# EAGLE design LowTemp (EAGLE 6.4)
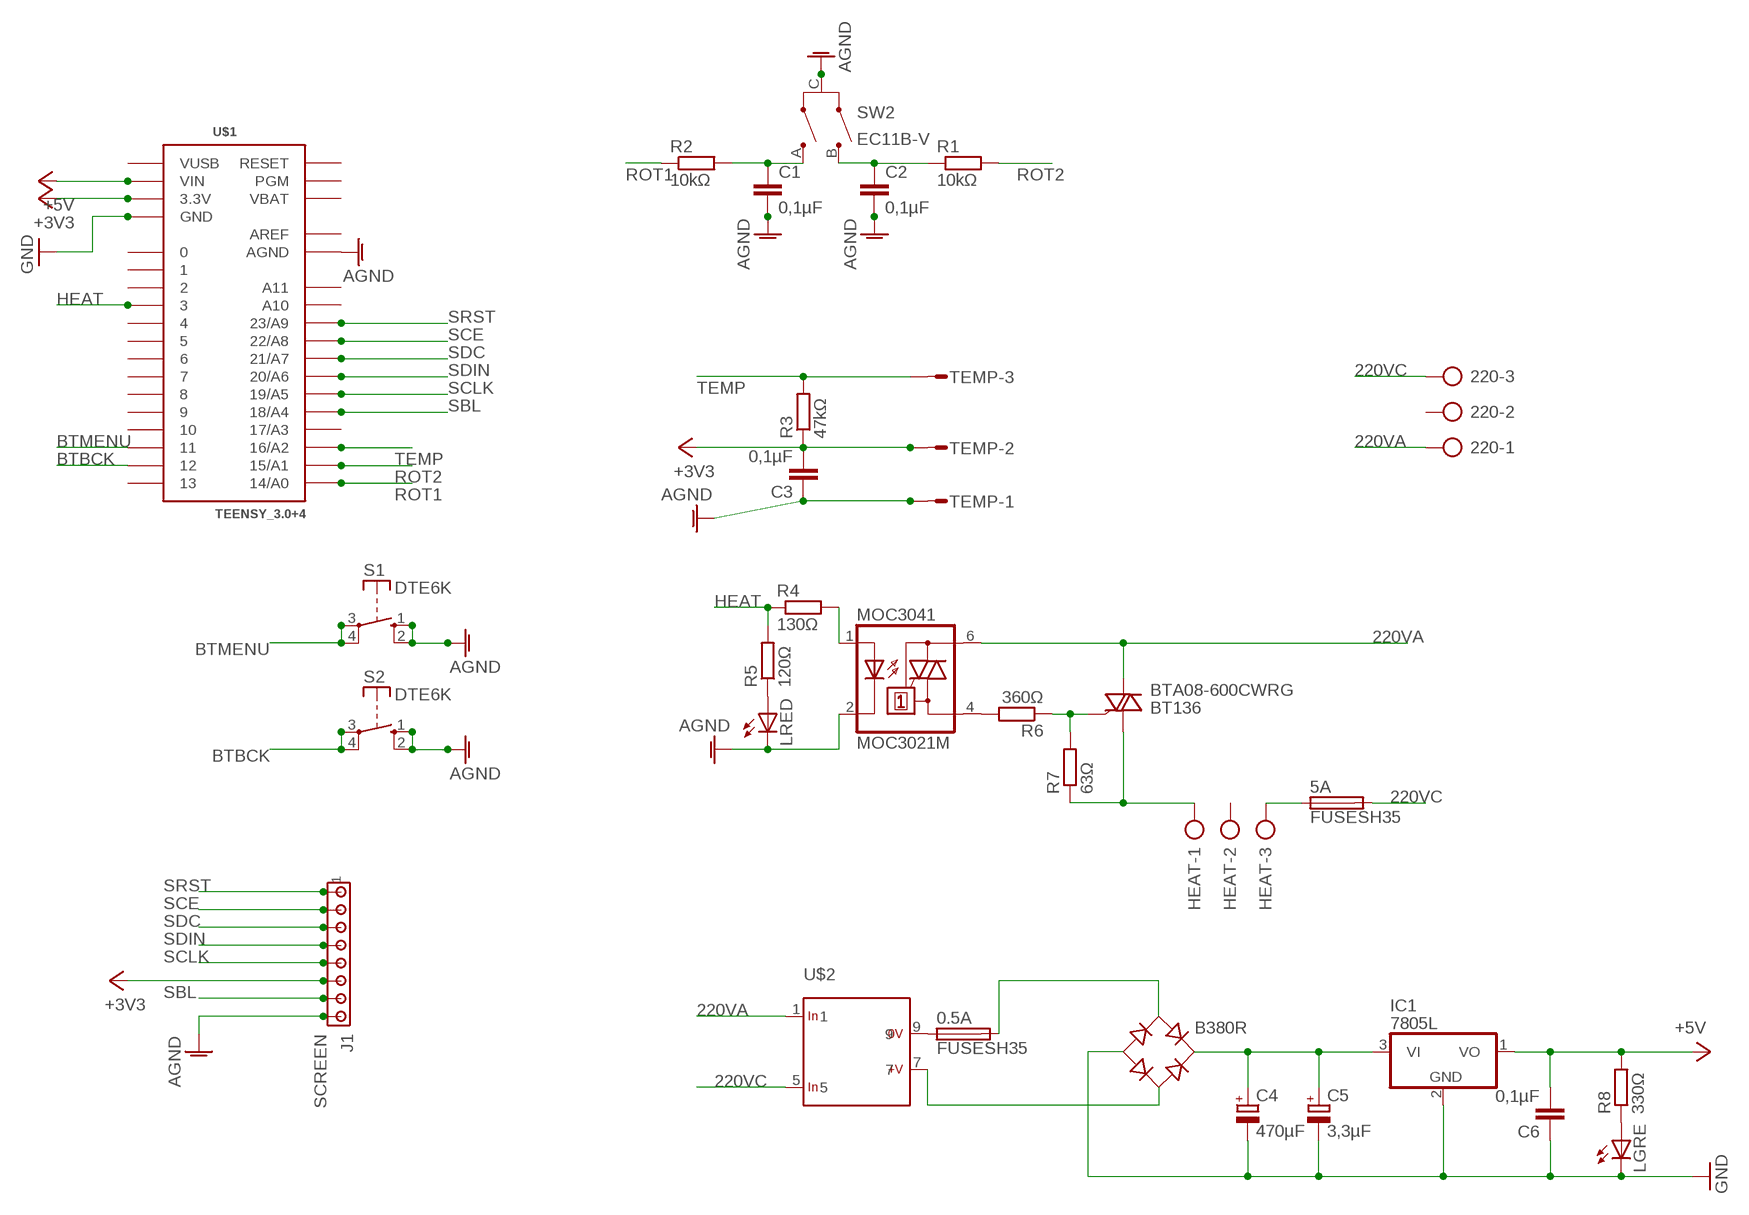
[diagram p0: schematic, sheet 1]

## Parts
0.5A  FUSESH35  [SH25]
5A  FUSESH35  [SH25]
220  AK500/3-H  [AK500/3-H]
B380R  RB1A  [RB1A]
BTA08-600CWRG  BT136  [TO220AB]
C1  0,1µF  C-EU050-025X075  [C050-025X075]
C2  0,1µF  C-EU050-025X075  [C050-025X075]
C3  0,1µF  C-EU050-025X075  [C050-025X075]
C4  470µF  CPOL-EUE5-8.5  [E5-8,5]
C5  3,3µF  CPOL-EUTT2D4  [TT2D4]
C6  0,1µF  C-EU050-025X075  [C050-025X075]
HEAT  AK500/3-H  [AK500/3-H]
IC1  7805L  [TO92]
J1  SCREEN  MTA08-100  [10X08MTA]
LGRE  LED5MM  [LED5MM]
LRED  LED5MM  [LED5MM]
MOC3041  MOC3021M  [DIL06]
R1  10kΩ  R-EU_0207/10  [0207/10]
R2  10kΩ  R-EU_0207/10  [0207/10]
R3  47kΩ  R-EU_0207/10  [0207/10]
R4  130Ω  R-EU_0207/10  [0207/10]
R5  120Ω  R-EU_0207/10  [0207/10]
R6  360Ω  R-EU_0207/10  [0207/10]
R7  63Ω  R-EU_0207/10  [0207/10]
R8  330Ω  R-EU_0207/10  [0207/10]
S1  DTE6K  [DTE6K]
S2  DTE6K  [DTE6K]
SW2  EC11B-V  [EC11B-V]
TEMP  L03P  [L03P]
U$1  TEENSY_3.0+4  [TEENSY_3.0+4]
U$2  SINGLE  [1]

## Nets
220VA: 220.1 BTA08-600CWRG.2(A2) MOC3041.6(A2) U$2.1
220VC: 5A.2 220.3 U$2.5
+3V3: C3.2 J1.6 R3.1 TEMP.2 U$1.3.3V U$1.3.3V1(3.3V)
+5V: C6.2 IC1.1(VO) R8.2 U$1.VIN
AGND: C1.2 C2.2 C3.1 J1.8 LRED.K(C) MOC3041.2(C) S1.1(S) S1.2(S) S2.1(S) S2.2(S) SW2.C TEMP.1 U$1.AGND
BTBCK: S2.3(P) S2.4(P) U$1.12
BTMENU: S1.3(P) S1.4(P) U$1.11
GND: B380R.- C4.- C5.- C6.1 IC1.2(GND) LGRE.K(C) U$1.GND U$1.GND1(GND)
HEAT: R4.1 R5.2 U$1.3
N$1: C1.1 R2.2 SW2.A
N$2: C2.1 R1.1 SW2.B
N$3: MOC3041.1(A) R4.2
N$4: LRED.A R5.1
N$5: MOC3041.4(A1) R6.2
N$6: BTA08-600CWRG.3(G) R6.1 R7.2
N$7: 0.5A.1 U$2.9
N$8: BTA08-600CWRG.1(A1) HEAT.1 R7.1
N$9: 5A.1 HEAT.3
N$10: B380R.AC2 U$2.7
N$11: 0.5A.2 B380R.AC1
N$13: B380R.+ C4.+ C5.+ IC1.3(VI)
N$15: LGRE.A R8.1
ROT1: R2.1 U$1.14/A0
ROT2: R1.2 U$1.15/A1
SBL: J1.7 U$1.18/A4
SCE: J1.2 U$1.22/A8
SCLK: J1.5 U$1.19/A5
SDC: J1.3 U$1.21/A7
SDIN: J1.4 U$1.20/A6
SRST: J1.1 U$1.23/A9
TEMP: R3.2 TEMP.3 U$1.16/A2
Unconnected: 220.2 HEAT.2 U$1.0 U$1.1 U$1.2 U$1.4 U$1.5 U$1.6 U$1.7 U$1.8 U$1.9 U$1.10 U$1.13 U$1.17/A3 U$1.A10 U$1.A11 U$1.PGM U$1.RESET

## Power pins joined to a net without a drawn wire
AREF: U$1.AREF
VBAT: U$1.VBAT
VUSB: U$1.VUSB

## Library data of the parts
0.5A 5A = fuse:FUSE: Fuse; OC_FARNELL: unknown; OC_NEWARK: unknown
220 HEAT = con-ptr500:AK500/3-H: CONNECTOR Aug. 2004 / PTR Meßtechnik: Die Bezeichnung der Serie AK505 wurde geändert. Es handelt sich hierbei um AK500 in horizontaler Ausführung.; OC_FARNELL: unknown; OC_NEWARK: unknown
B380R = rectifier:RB1A: RECTIFIER 1 A
BTA08-600CWRG = triac:BT136: Triac BT136 series E sensitive gate Source: http://www.nxp.com/acrobat_download/datasheets/BT136_SERIES_E_2.pdf
C1-C3 C6 = resistor:C-EU: CAPACITOR, European symbol
C4 C5 = resistor:CPOL-EU: POLARIZED CAPACITOR, European symbol
IC1 = linear:78*: Positive VOLTAGE REGULATOR Source: http://cache.national.com/ds/LM/LM78L05.pdf http://www.fairchildsemi.com/ds/LM/LM7805.pdf
J1 = con-amp:MTA08-100: AMP connector
LGRE LRED = led:LED: LED OSRAM: - CHIPLED LG R971, LG N971, LY N971, LG Q971, LY Q971, LO R971, LY R971 LH N974, LH R974 LS Q976, LO Q976, LY Q976 LO Q996 - Hyper CHIPLED LW Q18S LB Q993, LB Q99A, LB R99A - SideLED LS A670, LO A670, LY A670, LG A670, LP A670 LB A673, LV A673, LT A673, LW A673 LH A674 LY A675 LS A676, LA A676, LO A676, LY A676, LW A676 LS A679, LY A679, LG A679 - Hyper Micro SIDELED® LS Y876, LA Y876, LO Y876, LY Y876 LT Y87S - SmartLED LW L88C, LW L88S LB L89C, LB L89S, LG L890 LS L89K, LO L89K, LY L89K LS L896, LA L896, LO L896, LY L896 - TOPLED LS T670, LO T670, LY T670, LG T670, LP T670 LSG T670, LSP T670, LSY T670, LOP T670, LYG T670 LG T671, LOG T671, LSG T671 LB T673, LV T673, LT T673, LW T673 LH T674 LS T676, LA T676, LO T676, LY T676, LB T676, LH T676, LSB T676, LW T676 LB T67C, LV T67C, LT T67C, LS T67K, LO T67K, LY T67K, LW E67C LS E67B, LA E67B, LO E67B, LY E67B, LB E67C, LV E67C, LT E67C LW T67C LS T679, LY T679, LG T679 LS T770, LO T770, LY T770, LG T770, LP T770 LB T773, LV T773, LT T773, LW T773 LH T774 LS E675, LA E675, LY E675, LS T675 LS T776, LA T776, LO T776, LY T776, LB T776 LHGB T686 LT T68C, LB T68C - Hyper Mini TOPLED® LB M676 - Mini TOPLED Santana® LG M470 LS M47K, LO M47K, LY M47K Source: http://www.osram.convergy.de LUXEON: - LUMILED® LXK2-PW12-R00, LXK2-PW12-S00, LXK2-PW14-U00, LXK2-PW14-V00 LXK2-PM12-R00, LXK2-PM12-S00, LXK2-PM14-U00 LXK2-PE12-Q00, LXK2-PE12-R00, LXK2-PE12-S00, LXK2-PE14-T00, LXK2-PE14-U00 LXK2-PB12-K00, LXK2-PB12-L00, LXK2-PB12-M00, LXK2-PB14-N00, LXK2-PB14-P00, LXK2-PB14-Q00 LXK2-PR12-L00, LXK2-PR12-M00, LXK2-PR14-Q00, LXK2-PR14-R00 LXK2-PD12-Q00, LXK2-PD12-R00, LXK2-PD12-S00 LXK2-PH12-R00, LXK2-PH12-S00 LXK2-PL12-P00, LXK2-PL12-Q00, LXK2-PL12-R00 Source: www.luxeon.com KINGBRIGHT: KA-3528ASYC Source: www.kingbright.com
MOC3041 = optocoupler:MOC30*M: RANDOM-PHASE OPTOISOLATORS TRIAC DRIVER OUTPUT Source: http://www.fairchildsemi.com MOC3020-M.pdf; MF: FAIRCHILD SEMICONDUCTOR; MPN: MOC3021-M; OC_FARNELL: 1021365; OC_NEWARK: 95B7895
R1-R8 = resistor:R-EU_: RESISTOR, European symbol
S1 S2 = switch-misc:DT: ITT SWITCH
SW2 = alps:EC11B-V: ALPS EC11B Vertikal Ohne Taster Drehimpulsgeber 11 mm
TEMP = con-amp-mt:L03P: AMP MT CONNECTOR; OC_FARNELL: unknown; OC_NEWARK: unknown
U$1 = Teensy3.0:TEENSY_3.0+4: Teensy 3.0 board, showing all pins that are easily acessible. See 'AllAnalogPins" and 'AllPins' packages for additional pin holes, as needed. The 'Basic' package has fewer pins.
U$2 = myrra:SINGLE: One Output Input voltage range: 85 to 265 V AC or 85 to 370 V DC Input frequency: 47 to 440 Hz Output voltage accuracy (full load ): ± 2% Line output voltage variation: ± 0.3% Load output voltage variation: ± 0.5% Temperature range: -25 - TA (°C) No load input power: < 200mW regulated: Reference Output Current Power Efficiency Ta Volts mA Watts % °C 47121 3.3 750 2.5 65 +70 47122 5 550 2.75 68 +70 47123 9 270 2.5 72 +70 47124 12 210 2.5 74 +70 47125 15 170 2.5 75 +70 47126 24 110 2.5 77 +70 47151 3.3 1350 4.2 65 +50 47152 5 900 4.5 68 +50 47153 9 550 5 72 +50 47154 12 420 5 75 +50 47155 15 320 5 76 +50 47156 24 220 5 79 +50 non regulated: Reference Output Current Power Efficiency Ta Volts mA Watts % °C 47114 12 200 2.4 74 +70 47133 9 360 3.2 73 +70 47134 12 270 3.2 75 +70 47136 24 130 3.2 80 +70 47163 9 560 5* 73 +50 47164 12 420 5* 75 +50 47166 24 210 5* 80 +50 * Nota: Power up to 5.4W is possible with input voltage > 97 V AC Source: http://www.myrra.com

## Board
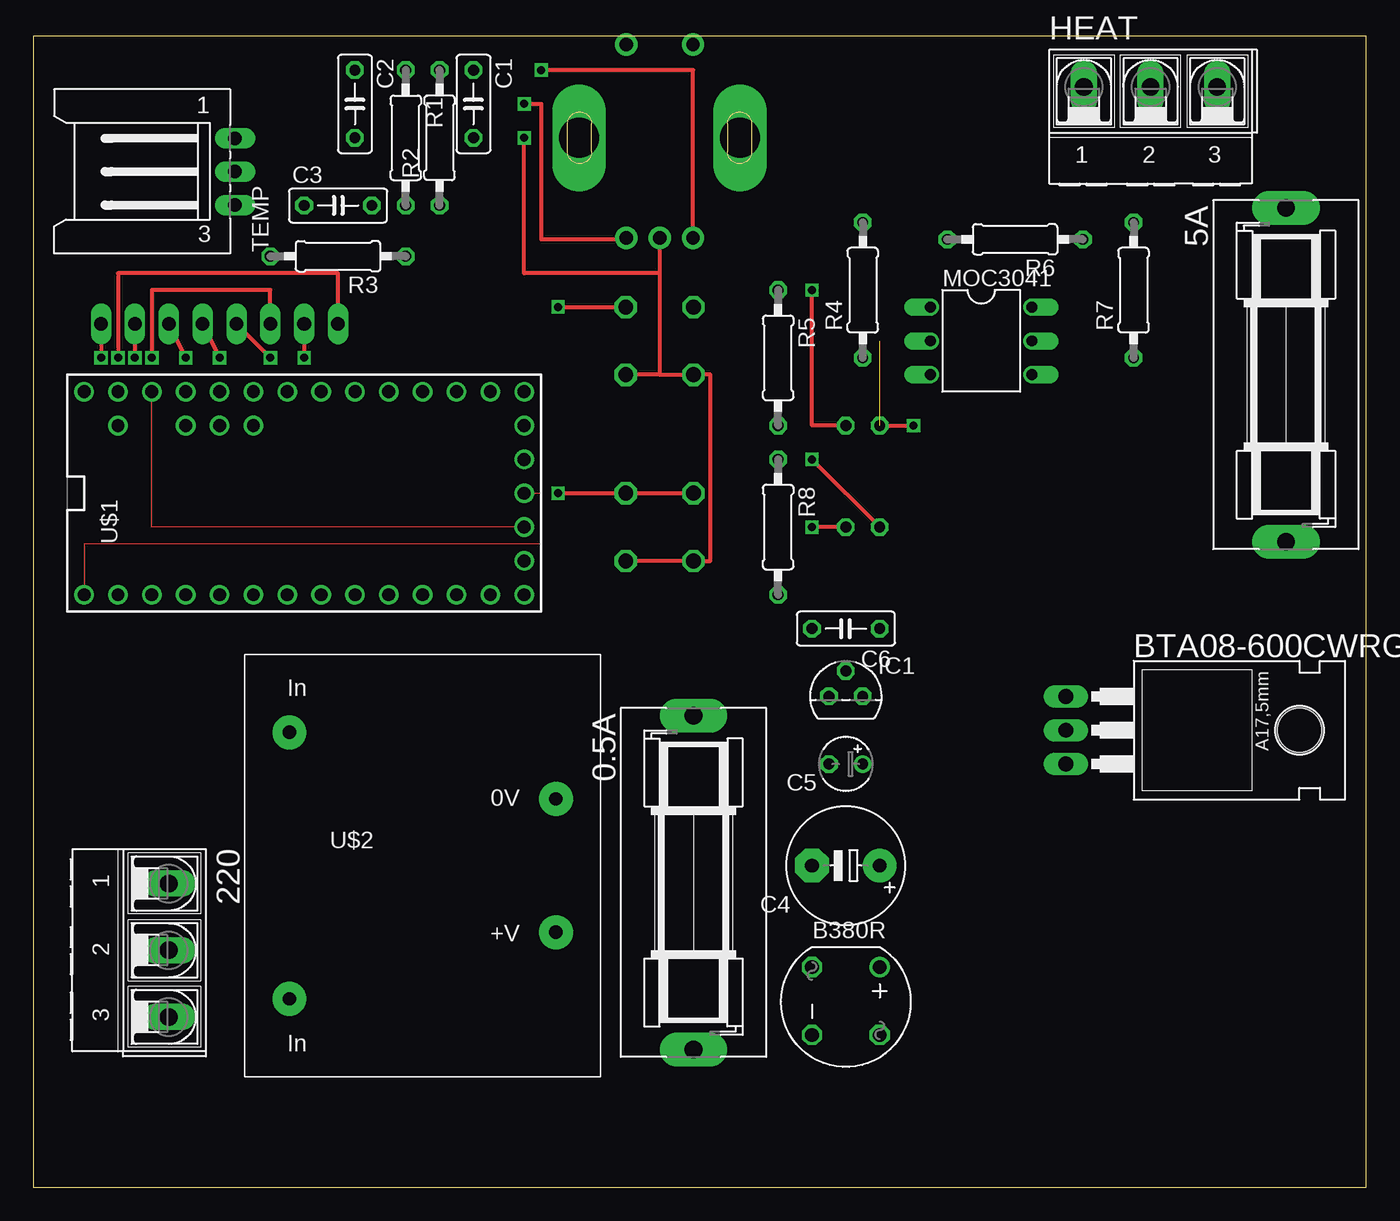
[diagram p1: board, top side]
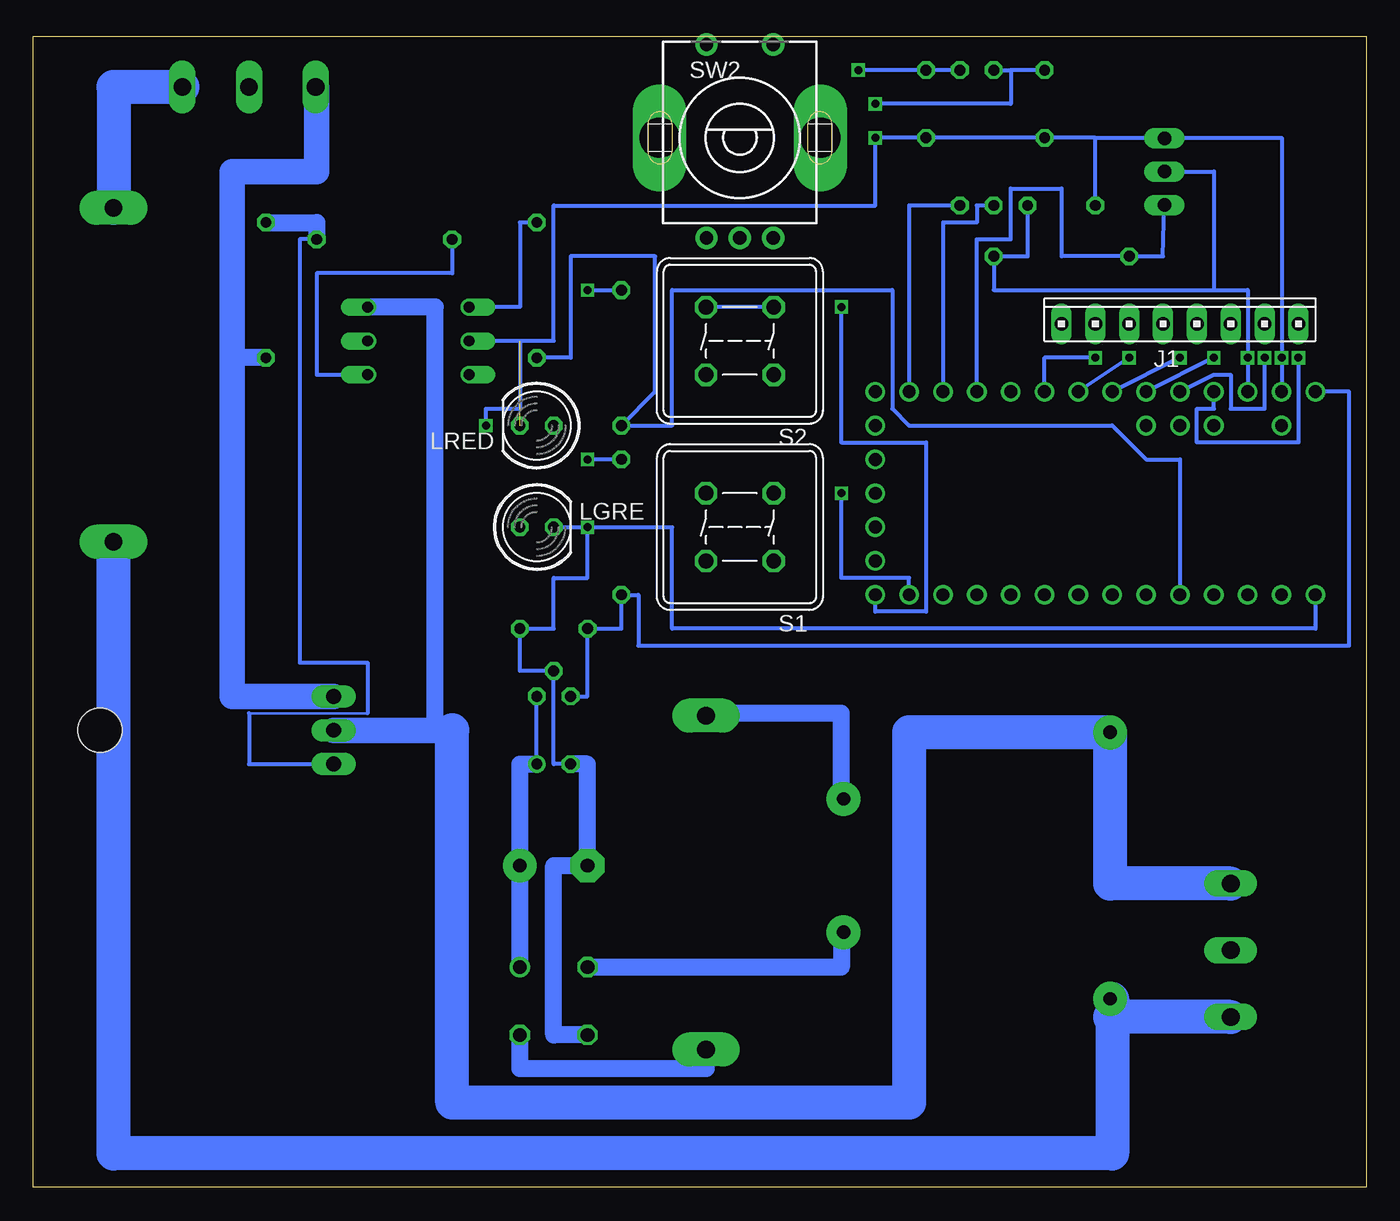
[diagram p2: board, bottom side, seen from below]

Size 100 x 86.35 mm. Coordinates in mm from the lower left corner, seen from the top.
Outline: 0,0 100,0 100,86.35 0,86.35 0,0
Copper layers (1*16): Top 0.035mm / dielectric 1.5mm / Bottom 0.035mm
Design rules "default": minimum track width 10mil, minimum drill 24mil, track to track 8mil, track to pad 8mil, pad to pad 8mil, via to via 8mil, smd to smd 8mil, copper to edge 40mil, drill to drill 8mil, minimum pad ring 10mil, minimum via ring 8mil, stop-mask expansion 4mil, vias tented up to drill 0mil, thermal gap 10mil

### Footprints (pad centres in the part's own frame; a part is rotated, then mirrored left to right if it is on the bottom)
SH25 = drill 1.321 pad 2.54 long: 1 -12.522,0; 2 12.522,0
AK500/3-H = drill 1.321 long: 1 -5.004,0; 2 0,0; 3 5.004,0
RB1A = drill 1.016: + -2.54,2.54 | drill 1.016 octagon: - 2.54,-2.54; AC1 2.54,2.54; AC2 -2.54,-2.54
TO220AB = drill 1.118 long: 1 -2.54,-6.35; 2 0,-6.35; 3 2.54,-6.35 | hole 3.302: 0,11.176
C050-025X075 = drill 0.813 octagon: 1 -2.54,0; 2 2.54,0
E5-8,5 = drill 1.016 pad 2.54: + -2.54,0 | drill 1.016 pad 2.54 octagon: - 2.54,0
TT2D4 = drill 0.813: + -1.27,0 | drill 0.813 octagon: - 1.27,0
TO92 = drill 0.813 octagon: 1 -1.27,0; 2 0,1.905; 3 1.27,0
10X08MTA = drill 1.016 long: 1 8.89,0; 2 6.35,0; 3 3.81,0; 4 1.27,0; 5 -1.27,0; 6 -3.81,0; 7 -6.35,0; 8 -8.89,0
LED5MM = drill 0.813 octagon: A -1.27,0; K 1.27,0
DIL06 = drill 0.813 offset: 1 -2.54,-3.81; 2 0,-3.81; 3 2.54,-3.81; 4 2.54,3.81; 5 0,3.81; 6 -2.54,3.81
0207/10 = drill 0.813 octagon: 1 -5.08,0; 2 5.08,0
DTE6K = drill 1.118 octagon: 1 -2.54,2.54; 2 2.54,2.54; 3 2.54,-2.54; 4 -2.54,-2.54
EC11B-V = drill 1 pad 1.676: A -2.5,-7.5; B 2.5,-7.5; C 0,-7.5; D -2.5,7; E 2.5,7 | drill 3 pad 3.3 long: G1 -6.032,0; G2 6.032,0
L03P = drill 1.016 long: 1 2.5,-6.25; 2 0,-6.25; 3 -2.5,-6.25
TEENSY_3.0+4 = drill 0.965: 0 -7.62,13.97; 1 -7.62,11.43; 2 -7.62,8.89; 3 -7.62,6.35; 3.3V 7.62,11.43; 3.3V1 -2.54,-16.51; 4 -7.62,3.81; 5 -7.62,1.27; 6 -7.62,-1.27; 7 -7.62,-3.81; 8 -7.62,-6.35; 9 -7.62,-8.89; 10 -7.62,-11.43; 11 -7.62,-13.97; 12 -7.62,-16.51; 13 7.62,-16.51; 14/A0 7.62,-13.97; 15/A1 7.62,-11.43; 16/A2 7.62,-8.89; 17/A3 7.62,-6.35; 18/A4 7.62,-3.81; 19/A5 7.62,-1.27; 20/A6 7.62,1.27; 21/A7 7.62,3.81; 22/A8 7.62,6.35; 23/A9 7.62,8.89; A10 5.08,6.35; A11 5.08,3.81; AGND 7.62,13.97; AREF 5.08,8.89; GND -7.62,16.51; GND1 0,-16.51; PGM 2.54,-16.51; RESET 5.08,-16.51; VBAT -5.08,-16.51; VIN 7.62,16.51; VUSB 5.08,13.97
1 = drill 1 pad 2.54: 1 -10,10; 5 -10,-10; 7 10,-5; 9 10,5

### Placement (x,y rotation side)
0.5A  49.53,22.86 270 top
5A  93.98,60.96 270 top
220  10.16,17.78 270 top
B380R  60.96,13.97 270 top
BTA08-600CWRG  83.82,34.29 270 top
C1  33.02,81.28 270 top
C2  24.13,81.28 270 top
C3  22.86,73.66 0 top
C4  60.96,24.13 180 top
C5  60.96,31.75 180 top
C6  60.96,41.91 180 top
HEAT  83.82,82.55 0 top
IC1  60.96,36.83 0 top
J1  13.97,64.77 0 bottom
LGRE  62.23,49.53 0 bottom
LRED  62.23,57.15 180 bottom
MOC3041  71.12,63.5 270 top
R1  27.94,78.74 270 top
R2  30.48,78.74 90 top
R3  22.86,69.85 180 top
R4  62.23,67.31 90 top
R5  55.88,62.23 270 top
R6  73.66,71.12 180 top
R7  82.55,67.31 90 top
R8  55.88,49.53 270 top
S1  46.99,49.53 180 bottom
S2  46.99,63.5 180 bottom
SW2  46.99,78.74 0 bottom
TEMP  8.89,76.2 90 top
U$1  20.32,52.07 90 top
U$2  29.21,24.13 0 top

### Tracks (layer width: path | path; a pad name or v marks a point on that pad's centre or on a via)
220VA
  Bottom 1.27: 68.58,34.29 69.85,34.29 69.85,66.04 MOC3041.6
  Bottom 1.93: BTA08-600CWRG.2 69.85,34.29
  Bottom 2.54: 220.1 19.21,22.78 U$2.1 34.29,34.13 34.29,6.35 68.58,6.35 68.58,34.29
220VC
  Bottom 1.27: 19.21,12.78 U$2.5 19.05,14.13
  Bottom 2.54: 220.3 19.21,12.78 | 19.05,14.13 19.05,2.54 93.98,2.54 5A.2
+3V3  (via drill 0.6)
  Top 0: U$1.3.3V1 8.89,49.53 U$1.3.3V
  Top 0.305: J1.6 17.78,67.31 8.89,67.31 v8.89,62.23
  Bottom 0.305: U$1.3.3V v8.89,62.23 8.89,67.31 11.43,67.31 | 11.43,67.31 27.94,67.31 R3.1 25.4,69.85 C3.2 | TEMP.2 11.43,76.2 11.43,67.31
+5V
  Bottom 0.305: IC1.1 58.42,36.83 C6.2 55.88,41.91 R8.2 54.61,44.45 54.61,40.64 1.27,40.64 1.27,59.69 U$1.VIN
AGND  (via drill 0.6)  (1 unrouted)
  Top 0.305: J1.8 22.86,68.58 6.35,68.58 v6.35,62.23 | 46.99,68.58 46.99,60.96 | 46.99,60.96 S2.1 | 46.99,60.96 S2.2 50.8,60.96 50.8,46.99 S1.2 S1.1 | SW2.C 46.99,68.58 | 46.99,68.58 36.83,68.58 v36.83,78.74 | LRED.K v66.04,57.15
  Bottom 0.305: U$1.AGND v6.35,62.23 6.35,78.74 20.32,78.74 | 20.32,78.74 C2.2 C1.2 v36.83,78.74 36.83,73.66 60.96,73.66 60.96,63.5 63.5,63.5 | 63.5,63.5 MOC3041.2 | C3.1 20.32,78.74 | TEMP.1 20.28,78.7 20.32,78.74 | 63.5,63.5 63.5,58.42 66.04,58.42 v66.04,57.15
BTBCK  (via drill 0.6)
  Top 0.305: v39.37,66.04 S2.4
  Bottom 0.305: v39.37,66.04 39.37,55.88 33.02,55.88 33.02,43.18 36.83,43.18 U$1.12 | S2.4 S2.3
BTMENU  (via drill 0.6)
  Top 0.305: v39.37,52.07 S1.4 S1.3
  Bottom 0.305: U$1.11 34.29,45.72 39.37,45.72 v39.37,52.07
GND  (via drill 0.6)
  Top 0: U$1.GND1 38.1,52.07 38.1,48.26 3.81,48.26 U$1.GND
  Top 0.305: LGRE.K v58.42,49.53
  Bottom 0.305: C5.- 60.96,31.75 IC1.2 63.5,38.73 C6.1 60.96,41.91 60.96,45.72 58.42,45.72 v58.42,49.53 | U$1.GND 3.81,41.91 52.07,41.91 52.07,49.53 v58.42,49.53 | LGRE.K v58.42,49.53
  Bottom 1.27: B380R.- 60.96,11.43 60.96,24.13 C4.- 58.42,31.75 C5.-
HEAT
  Bottom 0.305: R4.1 59.69,62.23 59.69,69.85 53.34,69.85 53.34,59.69 R5.2 52.07,57.15 52.07,67.31 35.56,67.31 35.56,58.42 34.29,57.15 19.05,57.15 16.51,54.61 13.97,54.61 U$1.3
N$1  (via drill 0.6)
  Top 0.305: SW2.A 49.49,83.78 49.53,83.82 v38.1,83.82
  Bottom 0.305: R2.2 C1.1 v38.1,83.82
N$2  (via drill 0.6)
  Top 0.305: v36.83,81.28 38.1,81.28 38.1,71.12 44.49,71.12 SW2.B
  Bottom 0.305: C2.1 26.67,83.82 | R1.1 26.67,83.82 | 26.67,83.82 26.67,81.28 v36.83,81.28
N$3
  Bottom 0.305: R4.2 63.5,72.39 63.5,66.04 MOC3041.1
N$4  (via drill 0.6)
  Top 0.305: LRED.A 58.42,57.15 v58.42,67.31
  Bottom 0.305: v58.42,67.31 R5.1
N$5
  Bottom 0.305: R6.2 68.58,68.58 78.74,68.58 78.74,60.96 MOC3041.4
N$6
  Bottom 0.2: 74.93,35.56 83.82,35.56
  Bottom 0.305: R6.1 80.01,71.12 80.01,39.37 74.93,39.37 74.93,35.56 | 83.82,35.56 83.82,31.75 BTA08-600CWRG.3
  Bottom 1.27: R7.2 78.74,72.39 R6.1
N$7
  Bottom 1.27: U$2.9 39.37,29.13 39.37,35.56 49.53,35.56 0.5A.1
N$8
  Bottom 0.305: HEAT.1 78.74,82.55
  Bottom 1.27: R7.1 85.09,62.23
  Bottom 1.93: BTA08-600CWRG.1 85.09,36.83 85.09,62.23 85.09,76.2 81.28,76.2 78.74,76.2 78.74,82.55
N$9
  Bottom 2.54: HEAT.3 93.98,82.55 5A.1
N$10
  Bottom 1.27: U$2.7 39.37,19.13 39.37,16.51 B380R.AC2
N$11
  Bottom 1.27: 0.5A.2 49.53,8.89 63.5,8.89 B380R.AC1
N$12  (via drill 0.6)
  other vias: 58.42,54.61
N$13
  Bottom 0.305: C5.+ IC1.3
  Bottom 1.27: B380R.+ C4.+ 63.5,31.75 C5.+
N$15
  Top 0.305: 58.42,54.61 LGRE.A
  Bottom 0.305: R8.1 58.42,54.61
ROT1
  Bottom 0.305: R2.1 34.29,73.66 U$1.14/A0
ROT2
  Bottom 0.305: R1.2 29.21,73.66 29.21,72.39 31.75,72.39 U$1.15/A1
SBL  (via drill 0.6)
  Top 0.305: J1.7 v20.32,62.23
  Bottom 0.305: U$1.18/A4 24.13,62.23 v20.32,62.23
SCE  (via drill 0.6)
  Top 0.305: J1.2 v7.62,62.23
  Bottom 0.305: U$1.22/A8 11.43,60.96 10.16,60.96 10.16,58.42 7.62,58.42 v7.62,62.23
SCLK  (via drill 0.6)
  Top 0.305: J1.5 v17.78,62.23
  Bottom 0.305: v17.78,62.23 U$1.19/A5
SDC  (via drill 0.6)
  Top 0.305: J1.3 v11.43,62.23
  Bottom 0.305: v11.43,62.23 U$1.21/A7
SDIN  (via drill 0.6)
  Top 0.305: J1.4 v13.97,62.23
  Bottom 0.305: v13.97,62.23 U$1.20/A6
SRST  (via drill 0.6)
  Top 0.305: J1.1 v5.08,62.23
  Bottom 0.305: v5.08,62.23 5.08,55.88 12.7,55.88 12.7,58.42 11.43,58.42 U$1.23/A9
TEMP
  Bottom 0.305: TEMP.3 15.24,69.85 R3.2 22.86,69.85 22.86,74.93 26.67,74.93 26.67,71.12 29.21,71.12 U$1.16/A2